# EAGLE design LightWalker (EAGLE 9.1.3)
LightWalker Schematic
REV: 3.0a
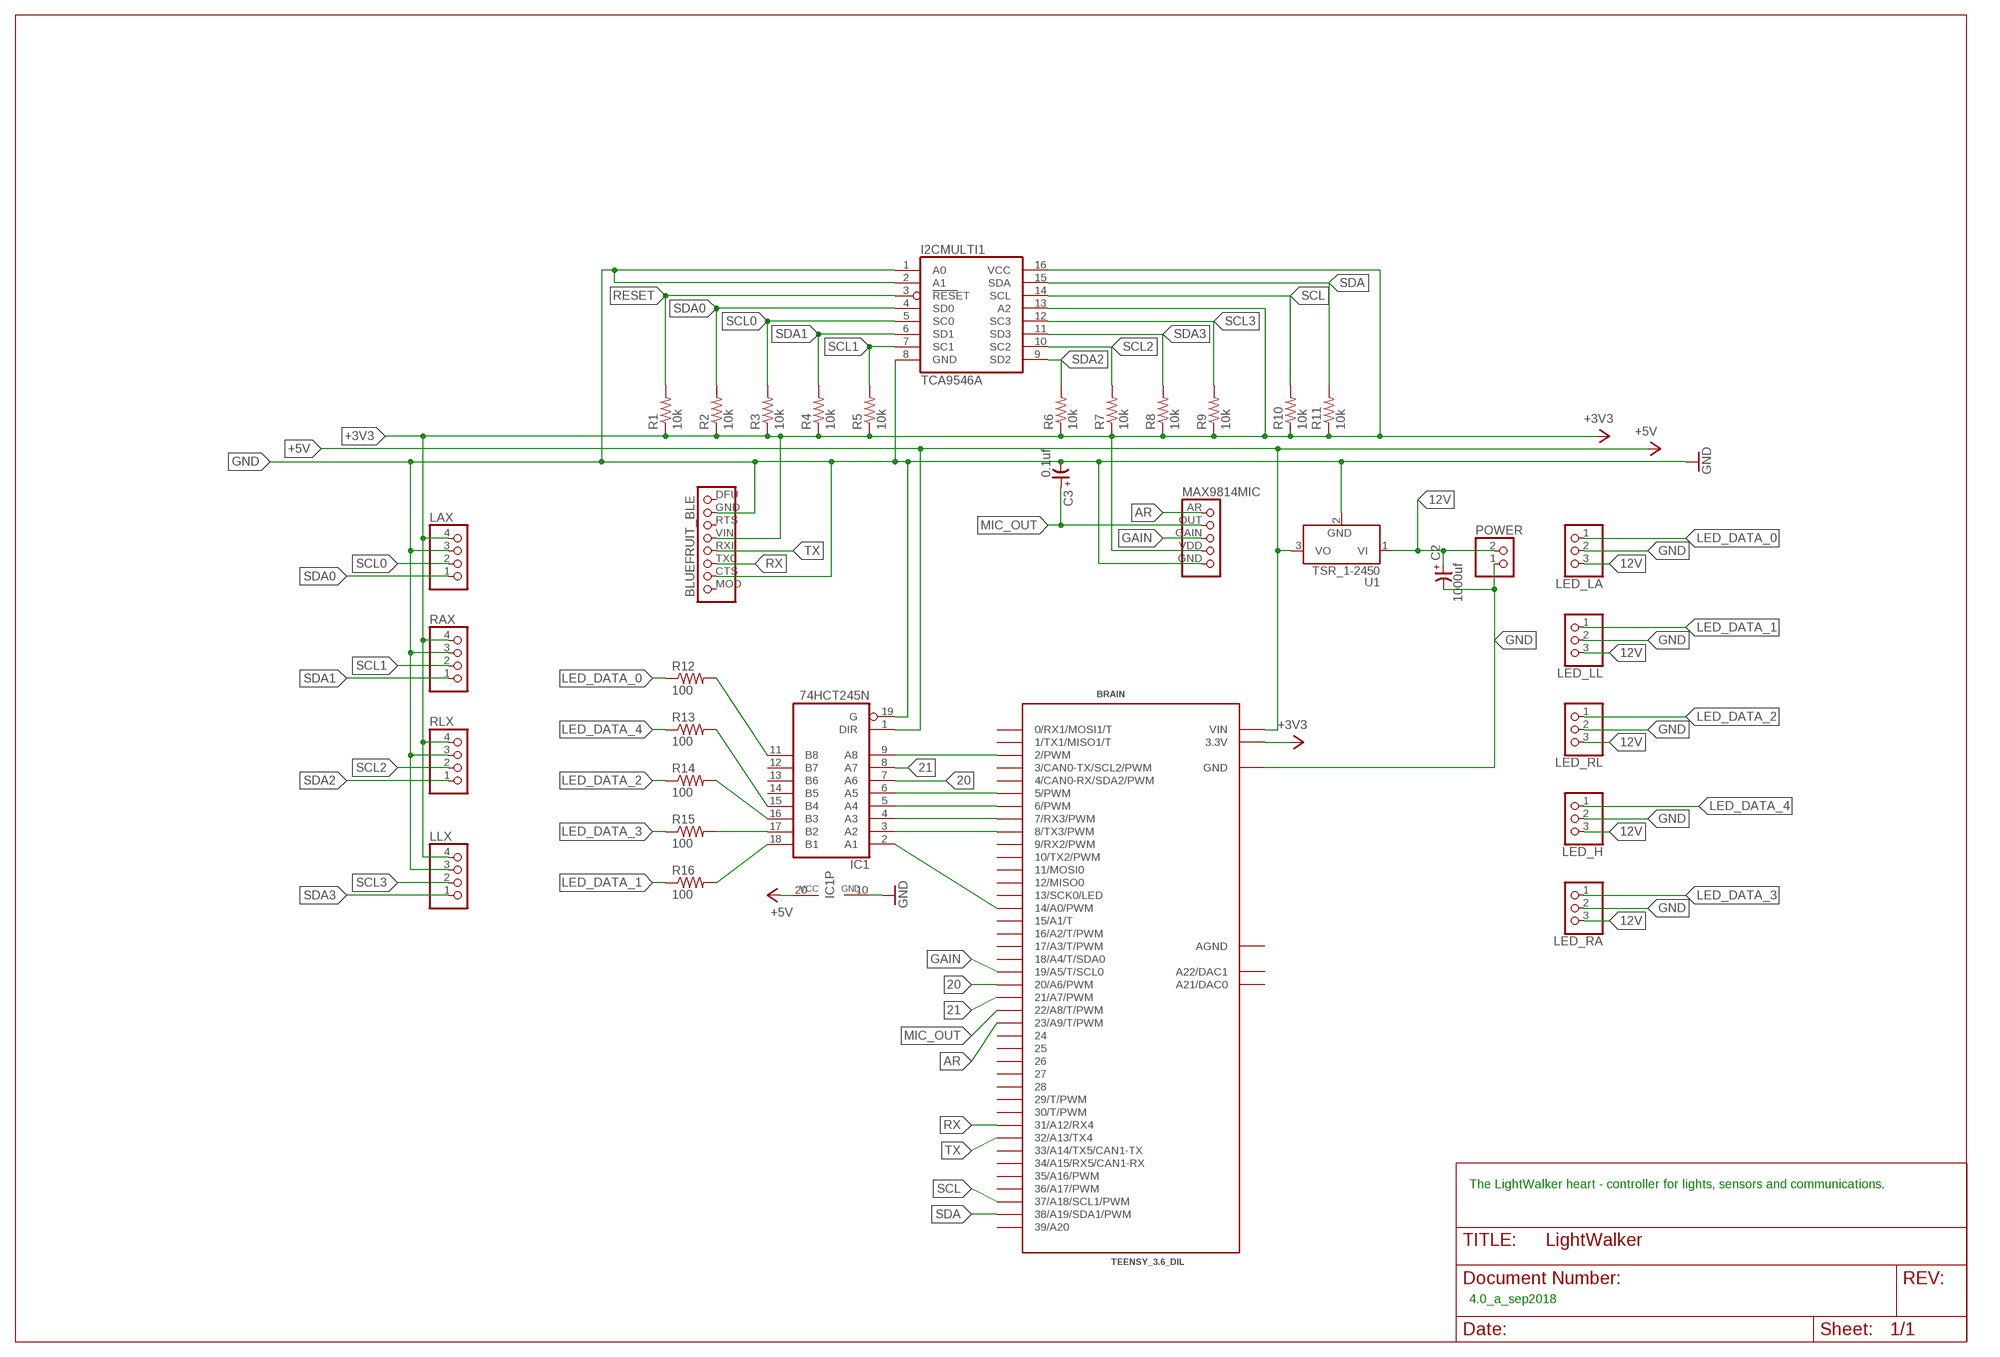
[diagram p0: schematic, sheet 1]

## Parts
BRAIN  TEENSY_3.6_DIL  [TEENSY_3.6_DIL]
C2  1000uf  CP-SV-K  [SV-K]
C3  0.1uf  CP-3225  [3225]
I2CMULTI1  TCA9546A  [SOIC16_LONGPAD]
IC1  74HCT245N  [DIL20]
LAX  2.54MM_TERMINAL_BLOCK-4  [TB_1X4]
LED_H  2.54MM_TERMINAL_BLOCK-3  [TB_1X3]
LED_LA  2.54MM_TERMINAL_BLOCK-3  [TB_1X3]
LED_LL  2.54MM_TERMINAL_BLOCK-3  [TB_1X3]
LED_RA  2.54MM_TERMINAL_BLOCK-3  [TB_1X3]
LED_RL  2.54MM_TERMINAL_BLOCK-3  [TB_1X3]
LLX  2.54MM_TERMINAL_BLOCK-4  [TB_1X4]
POWER  2.54MM_TERMINAL_BLOCK-2  [TB_1X2]
R1  10k  R-US_R1206  [R1206]
R2  10k  R-US_R1206  [R1206]
R3  10k  R-US_R1206  [R1206]
R4  10k  R-US_R1206  [R1206]
R5  10k  R-US_R1206  [R1206]
R6  10k  R-US_R1206  [R1206]
R7  10k  R-US_R1206  [R1206]
R8  10k  R-US_R1206  [R1206]
R9  10k  R-US_R1206  [R1206]
R10  10k  R-US_R1206  [R1206]
R11  10k  R-US_R1206  [R1206]
R12  100  R-US_R1206  [R1206]
R13  100  R-US_R1206  [R1206]
R14  100  R-US_R1206  [R1206]
R15  100  R-US_R1206  [R1206]
R16  100  R-US_R1206  [R1206]
RAX  2.54MM_TERMINAL_BLOCK-4  [TB_1X4]
RLX  2.54MM_TERMINAL_BLOCK-4  [TB_1X4]
U1  TSR_1-2450  [TSR-1]
U$1  BLUEFRUIT_BLE_UART_FRIENDALL  [BLUEFRUIT_BLE_UART_FRIEND_ALL]
U$4  MAX9814MICALL  [MAX9814MIC]

## Nets
12V: C2.+ LED_H.3 LED_LA.3 LED_LL.3 LED_RA.3 LED_RL.3 POWER.2 U1.1(VI)
20: BRAIN.20/A6(20/A6/PWM) IC1.7(A6)
21: BRAIN.21/A7(21/A7/PWM) IC1.8(A7)
+3V3: BRAIN.3.3V BRAIN.3.3V3(3.3V) I2CMULTI1.13(A2) I2CMULTI1.16(VCC) LAX.4 LLX.4 R1.1 R2.1 R3.1 R4.1 R5.1 R6.1 R7.1 R8.1 R9.1 R10.1 R11.1 RAX.4 RLX.4 U$1.VIN U$4.VDD
+5V: BRAIN.VIN IC1.1(DIR) IC1.20(VCC) U1.3(VO)
AR: BRAIN.23/A9(23/A9/T/PWM) U$4.AR
GAIN: BRAIN.19/A5(19/A5/T/SCL0) U$4.GAIN
GND: BRAIN.GND BRAIN.GND1(GND) C2.- C3.2(-) I2CMULTI1.1(A0) I2CMULTI1.2(A1) I2CMULTI1.8(GND) IC1.10(GND) IC1.19(G) LAX.3 LED_H.2 LED_LA.2 LED_LL.2 LED_RA.2 LED_RL.2 LLX.3 POWER.1 RAX.3 RLX.3 U1.2(GND) U$1.CTS U$1.GND U$4.GND
LED_DATA_0: LED_LA.1 R12.1
LED_DATA_1: LED_LL.1 R16.1
LED_DATA_2: LED_RL.1 R14.1
LED_DATA_3: LED_RA.1 R15.1
LED_DATA_4: LED_H.1 R13.1
MIC_OUT: BRAIN.22/A8(22/A8/T/PWM) C3.1(+) U$4.OUT
N$1: BRAIN.2(2/PWM) IC1.9(A8)
N$2: BRAIN.5(5/PWM) IC1.6(A5)
N$3: BRAIN.6(6/PWM) IC1.5(A4)
N$5: BRAIN.7(7/RX3/PWM) IC1.4(A3)
N$6: BRAIN.8(8/TX3/PWM) IC1.3(A2)
N$9: IC1.11(B8) R12.2
N$10: IC1.15(B4) R13.2
N$11: IC1.16(B3) R14.2
N$12: IC1.17(B2) R15.2
N$13: IC1.18(B1) R16.2
PIN14: BRAIN.14/A0(14/A0/PWM) IC1.2(A1)
RESET: I2CMULTI1.3(RESET) R1.2
RX: BRAIN.31/A12(31/A12/RX4) U$1.TX0(TXO)
SCL: BRAIN.37/A18(37/A18/SCL1/PWM) I2CMULTI1.14(SCL) R10.2
SCL0: I2CMULTI1.5(SC0) LAX.2 R3.2
SCL1: I2CMULTI1.7(SC1) R5.2 RAX.2
SCL2: I2CMULTI1.10(SC2) R7.2 RLX.2
SCL3: I2CMULTI1.12(SC3) LLX.2 R9.2
SDA: BRAIN.38/A19(38/A19/SDA1/PWM) I2CMULTI1.15(SDA) R11.2
SDA0: I2CMULTI1.4(SD0) LAX.1 R2.2
SDA1: I2CMULTI1.6(SD1) R4.2 RAX.1
SDA2: I2CMULTI1.9(SD2) R6.2 RLX.1
SDA3: I2CMULTI1.11(SD3) LLX.1 R8.2
TX: BRAIN.32/A13(32/A13/TX4) U$1.RXI
Unconnected: BRAIN.0(0/RX1/MOSI1/T) BRAIN.1(1/TX1/MISO1/T) BRAIN.3(3/CAN0-TX/SCL2/PWM) BRAIN.4(4/CAN0-RX/SDA2/PWM) BRAIN.9(9/RX2/PWM) BRAIN.10(10/TX2/PWM) BRAIN.11(11/MOSI0) BRAIN.12(12/MISO0) BRAIN.13(13/SCK0/LED) BRAIN.15/A1(15/A1/T) BRAIN.16/A2(16/A2/T/PWM) BRAIN.17/A3(17/A3/T/PWM) BRAIN.18/A4(18/A4/T/SDA0) BRAIN.24 BRAIN.25 BRAIN.26 BRAIN.27 BRAIN.28 BRAIN.29(29/T/PWM) BRAIN.30(30/T/PWM) BRAIN.33/A14(33/A14/TX5/CAN1-TX) BRAIN.34/A15(34/A15/RX5/CAN1-RX) BRAIN.35/A16(35/A16/PWM) BRAIN.36/A17(36/A17/PWM) BRAIN.39/A20 BRAIN.A21(A21/DAC0) BRAIN.A22(A22/DAC1) IC1.12(B7) IC1.13(B6) IC1.14(B5) U$1.DFU U$1.MOD U$1.RTS

## Notes on the sheet
- The LightWalker heart - controller for lights, sensors and communications.
- 4.0_a_sep2018

## Power pins joined to a net without a drawn wire
AGND: BRAIN.AGND

## Library data of the parts
BRAIN = Teensy3.0:TEENSY_3.6_DIL: Teensy 3.6 DIL Package
C2 = cap-master:CP-: POLARIZED CAP
C3 = cap-master.rpt:CP-: POLARIZED CAP
I2CMULTI1 = minty:TCA9546A
IC1 = 74xx-eu:74*245: Octal BUS TRANSCEIVER, 3-state
LAX LLX RAX RLX = minty:2.54MM_TERMINAL_BLOCK-4
LED_H LED_LA LED_LL LED_RA LED_RL = minty:2.54MM_TERMINAL_BLOCK-3
POWER = minty:2.54MM_TERMINAL_BLOCK-2
R1-R16 = resistor:R-US_: RESISTOR, American symbol
U1 = _traco_tsr-1:TSR_1-*: TRACO TSR-1 Series Point-of-Load DC/DC-Converters Vi max. 36 V; Vo = (1.2 .. 15)V ±2%; Io = 0 .. 1 A SIP-Package (drop-in replacement for 78xx linear voltage regulators in TO220-package, vertically assembled) Source: www.tracopower.com Technologies: TSR 1- Vi (V) Vo (V) ±2% Io = 0 .. 1 A 24_ ( generic ) 2412 4.6 .. 36 1.2 2415 4.6 .. 36 1.5 2418 4.6 .. 36 1.8 2425 4.6 .. 36 2.5 2433 4.75.. 36 3.3 2450 6.5 .. 36 5.0 2465 9.0 .. 36 6.5 2490 12 .. 36 9.0 24120 15 .. 36 12 24150 18 .. 36 15 Author: Dipl.-Ing. FH Rainer Bayer HHN Hochschule Heilbronn, rainer.bayer@hs-heilbronn.de Ingenieurbüro ing-rb, mail@ing-rb.de
U$1 = minty:BLUEFRUIT_BLE_UART_FRIEND
U$4 = minty:MAX9814MIC

## Board
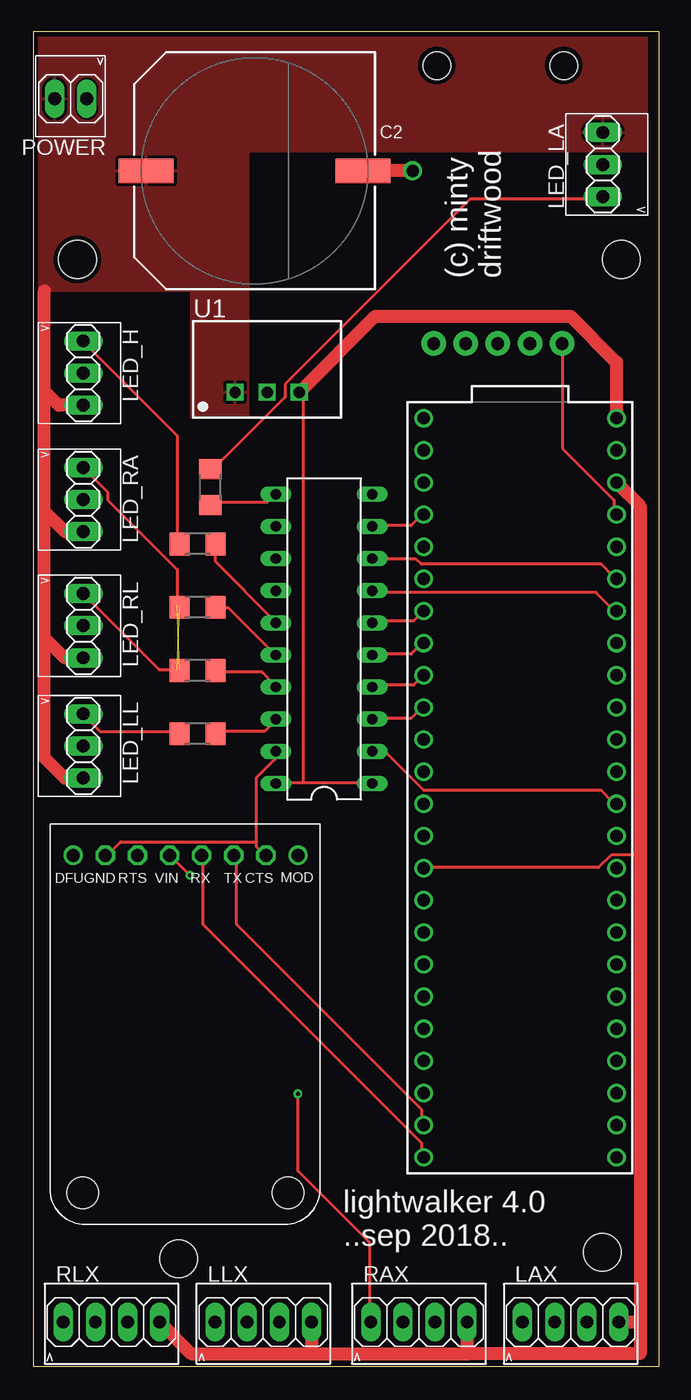
[diagram p1: board, top side]
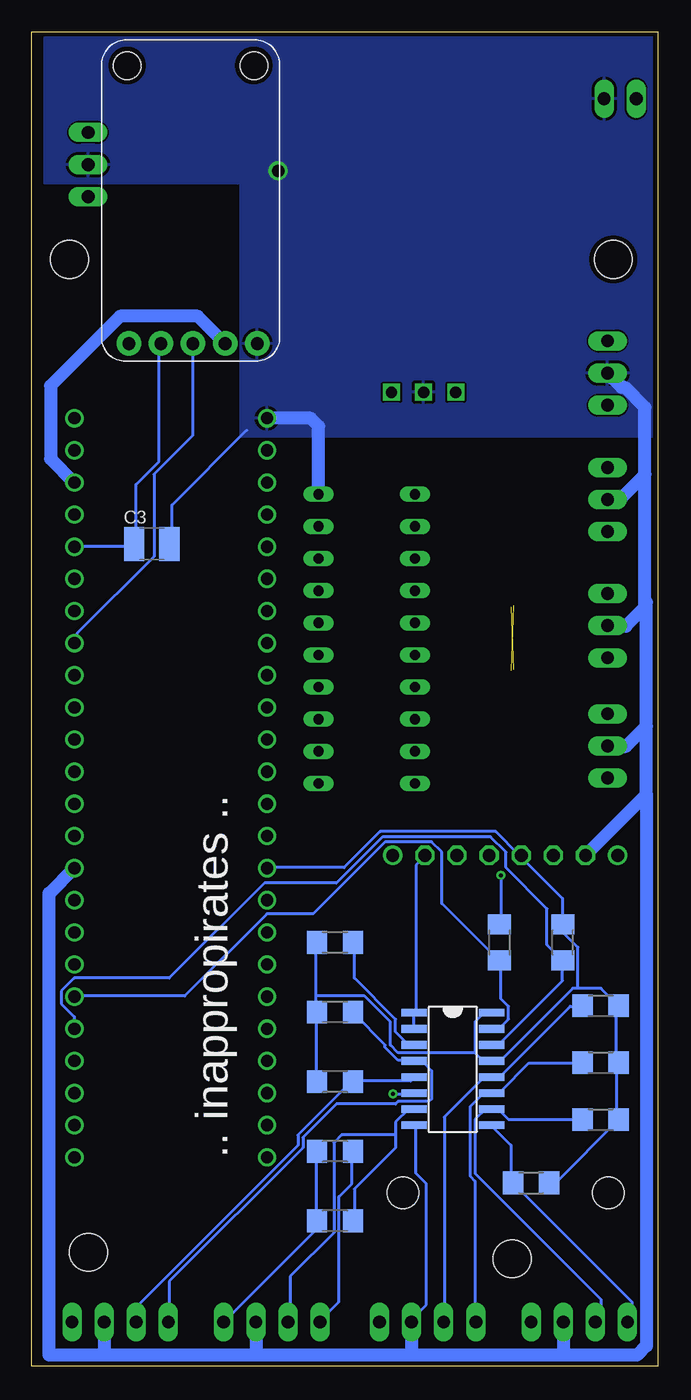
[diagram p2: board, bottom side, seen from below]

Size 49.5 x 105.5 mm. Coordinates in mm from the lower left corner, seen from the top.
Outline: 0,0 49.5,0 49.5,105.5 0,105.5 0,0
Copper layers (1*16): Top 0.0356mm / dielectric 1.5011mm / Bottom 0.0356mm
Design rules "LaenPCBOrder *": minimum track width 10mil, minimum drill 13mil, track to track 6mil, track to pad 6mil, pad to pad 6mil, via to via 6mil, smd to smd 6mil, copper to edge 15mil, drill to drill 6mil, minimum pad ring 7mil, minimum via ring 7mil, stop-mask expansion 3mil, vias tented up to drill 0mil, thermal gap 10mil
Holes 3 mm at 3.5,87.5 46.5,87.5 11.5,8.5 45,9

### Footprints (pad centres in the part's own frame; a part is rotated, then mirrored left to right if it is on the bottom)
TEENSY_3.6_DIL = drill 0.965: 0 -7.62,25.4; 1 -7.62,22.86; 2 -7.62,20.32; 3 -7.62,17.78; 3.3V 7.62,22.86; 3.3V3 -7.62,-7.62; 4 -7.62,15.24; 5 -7.62,12.7; 6 -7.62,10.16; 7 -7.62,7.62; 8 -7.62,5.08; 9 -7.62,2.54; 10 -7.62,0; 11 -7.62,-2.54; 12 -7.62,-5.08; 13 7.62,-5.08; 14/A0 7.62,-2.54; 15/A1 7.62,0; 16/A2 7.62,2.54; 17/A3 7.62,5.08; 18/A4 7.62,7.62; 19/A5 7.62,10.16; 20/A6 7.62,12.7; 21/A7 7.62,15.24; 22/A8 7.62,17.78; 23/A9 7.62,20.32; 24 -7.62,-10.16; 25 -7.62,-12.7; 26 -7.62,-15.24; 27 -7.62,-17.78; 28 -7.62,-20.32; 29 -7.62,-22.86; 30 -7.62,-25.4; 31/A12 -7.62,-27.94; 32/A13 -7.62,-30.48; 33/A14 7.62,-30.48; 34/A15 7.62,-27.94; 35/A16 7.62,-25.4; 36/A17 7.62,-22.86; 37/A18 7.62,-20.32; 38/A19 7.62,-17.78; 39/A20 7.62,-15.24; A21 7.62,-12.7; A22 7.62,-10.16; AGND 7.62,25.4; GND -7.62,27.94; GND1 7.62,-7.62; VIN 7.62,27.94
SV-K = smd 4.318 x 1.93: + -8.572,0; - 8.572,0
3225 = smd 1.6 x 2.7: 1 -1.4,0; 2 1.4,0
SOIC16_LONGPAD = smd 0.61 x 2.032: 1 -4.445,-3.251; 2 -3.175,-3.251; 3 -1.905,-3.251; 4 -0.635,-3.251; 5 0.635,-3.251; 6 1.905,-3.251; 7 3.175,-3.251; 8 4.445,-3.251; 9 4.445,2.87; 10 3.175,2.87; 11 1.905,2.87; 12 0.635,2.87; 13 -0.635,2.87; 14 -1.905,2.87; 15 -3.175,2.87; 16 -4.445,2.87
DIL20 = drill 0.813 long: 1 -11.43,-3.81; 2 -8.89,-3.81; 3 -6.35,-3.81; 4 -3.81,-3.81; 5 -1.27,-3.81; 6 1.27,-3.81; 7 3.81,-3.81; 8 6.35,-3.81; 9 8.89,-3.81; 10 11.43,-3.81; 11 11.43,3.81; 12 8.89,3.81; 13 6.35,3.81; 14 3.81,3.81; 15 1.27,3.81; 16 -1.27,3.81; 17 -3.81,3.81; 18 -6.35,3.81; 19 -8.89,3.81; 20 -11.43,3.81
TB_1X4 = drill 1.016 long: 1 -3.81,-0.1; 2 -1.27,-0.1; 3 1.27,-0.1; 4 3.81,-0.1
TB_1X3 = drill 1.016 long: 1 -2.55,-0.04; 2 -0.01,-0.04; 3 2.53,-0.04
TB_1X2 = drill 1.016 long: 1 -1.23,-0.2; 2 1.31,-0.2
R1206 = smd 1.6 x 1.803: 1 -1.422,0; 2 1.422,0
TSR-1 = drill 0.9 square: 1 -2.54,0; 2 0,0; 3 2.54,0
BLUEFRUIT_BLE_UART_FRIEND_ALL = drill 1.016 octagon: CTS 4.1,2.61; GND 16.8,2.61; RTS 14.26,2.61; RXI 9.18,2.61; TX0 6.64,2.61; VIN 11.72,2.61 | drill 1.016: DFU 19.34,2.61; MOD 1.56,2.61 | hole 2.5: 2.35,29.3; 18.6,29.3
MAX9814MIC = drill 1 pad 1.93: AR -10.16,4.318; GAIN -10.16,-0.762; GND -10.16,-5.842; OUT -10.16,1.778; VDD -10.16,-3.302 | hole 2.2: 11.811,4.445; 11.811,-5.588

### Placement (x,y rotation side)
BRAIN  38.5,47 0 top
C2  17.5,94.5 0 top
C3  40,65 0 bottom
I2CMULTI1  16,23.5 270 bottom
IC1  23,57.5 90 top
LAX  42.5,3.6 0 top
LED_H  4,78.5 270 top
LED_LA  45,95 90 top
LED_LL  4,49.03 270 top
LED_RA  4,68.5 270 top
LED_RL  4,58.53 270 top
LLX  18.19,3.6 0 top
POWER  3,100 180 top
R1  25.5,33.5 0 bottom
R2  25.5,28 0 bottom
R3  25.5,22.5 0 bottom
R4  25.5,17 0 bottom
R5  25.5,11.5 0 bottom
R6  10,14.5 180 bottom
R7  4.5,19.5 180 bottom
R8  4.5,24 180 bottom
R9  4.5,28.5 180 bottom
R10  7.5,33.5 270 bottom
R11  12.5,33.5 270 bottom
R12  14,69.5 270 top
R13  13,65 0 top
R14  13,60 0 top
R15  13,55 0 top
R16  13,50 0 top
RAX  30.5,3.6 0 top
RLX  6.19,3.6 0 top
U1  18.5,77 0 top
U$1  22.5,43 180 top
U$4  37.5,91 90 bottom

### Tracks (layer width: path | path; a pad name or v marks a point on that pad's centre or on a via)
12V
  Top 1.016: LED_H.3 2.03,75.97 0.89,77.11 | LED_RA.3 2.53,65.97 0.89,67.61 | 0.89,67.61 0.89,77.11 | LED_RL.3 2.5,56 0.89,57.61 | 0.89,57.61 0.89,67.61 | LED_LL.3 2.5,46.5 0.89,48.11 0.89,57.61 | 0.89,77.11 0.89,85
  pour Top: 0,105.5 48.5,105.5 48.5,96 17,96 17,75 12.5,75 12.5,85 0,85
20
  Top 0.254: IC1.7 26.82,61.16 44.5,61.16 45.92,59.74 BRAIN.20/A6
21
  Top 0.254: IC1.8 26.82,63.8 30.28,63.8 30.68,63.4 44.91,63.4 45.92,62.38 BRAIN.21/A7
+3V3  (via drill 0.33)
  Top 0.254: BRAIN.3.3V3 30.89,39.42 44.7,39.42 45.72,40.44 47.55,40.44 48,40.44 | v12.39,38.81 10.97,40.23 U$1.VIN
  Top 1.016: BRAIN.3.3V 48,67.98 48,40.44 48,3.66 | 34.5,1 48,1 48,3.66 | RAX.4 34.31,1.19 34.5,1 | LAX.4 47.84,3.5 48,3.66 | RLX.4 12.5,1 22,1 | 22,1 34.5,1 | LLX.4 22,1
  Bottom 0.254: R4.1 27.03,16.87 27.03,11.58 R5.1 27.03,11.38 27.03,10.77 34.14,3.66 RAX.4 | v12.39,38.81 12.39,34.95 R11.1 | R3.1 27.03,22.55 27.03,27.84 R2.1 27.03,28.04 27.03,29.26 | 27.03,29.26 27.03,33.33 R1.1 | 14.43,24.79 13.82,24.18 13.21,24.18 I2CMULTI1.13 13.01,24.18 12.39,24.18 6.71,29.87 6.3,29.87 | 14.43,24.79 14.43,27.23 13.82,27.84 13.21,27.84 I2CMULTI1.16 | R6.1 8.53,14.63 7.92,14.63 3.25,19.3 R7.1 3.25,19.51 3.25,23.98 R8.1 3.25,24.18 3.25,28.45 R9.1 3.25,28.65 4.47,29.87 6.3,29.87 | 27.03,29.26 23.16,29.26 21.13,27.23 21.13,25.4 20.52,24.79 14.43,24.79 | 6.3,29.87 6.3,33.12 7.32,34.14 7.32,34.75 R10.1 7.52,34.95 7.52,36.98 10.77,40.23 U$1.VIN 10.97,40.44 12.8,42.27 21.95,42.27 24.79,39.42 30.68,39.42 BRAIN.3.3V3
  Bottom 1.016: U$4.VDD 36.36,83 42.5,83 48,77.5 48,71.74 BRAIN.3.3V
+5V
  Top 0.254: 21.34,46.13 26.62,46.13 IC1.1 | 21.34,46.13 19.3,46.13 IC1.20 | 21.34,46.13 21.34,76.61 U1.3
  Top 1.016: U1.3 27.04,83 42.5,83 46.12,79.38 BRAIN.VIN
AR
  Top 0.254: BRAIN.23/A9 45.92,67.46 45.92,68.48 41.86,72.54 41.86,80.67 U$4.AR
GAIN
  Bottom 0.254: BRAIN.19/A5 45.92,57.3 45.92,57.91 39.83,64.01 39.83,70.51 36.78,73.56 36.78,80.67 U$4.GAIN
GND  (via drill 1)
  Top 0.254: 17.68,41.45 17.68,41.05 18.29,40.44 U$1.CTS | 17.68,41.45 17.68,46.53 19.1,47.95 19.1,48.56 IC1.19 | 17.68,41.45 6.91,41.45 5.89,40.44 U$1.GND
  Top 1.016: v30,94.5 C2.-
  Bottom 0.254: C3.2 38.41,65.02 38.41,68.09 32.5,74 | I2CMULTI1.2 19.3,26.82 19.3,27.84 I2CMULTI1.1 19.1,28.04 19.1,39.62 18.49,40.23 U$1.CTS | I2CMULTI1.8 19.1,18.9 19.1,15.24 18.29,14.43 18.29,4.88 19.3,3.86 LLX.3
  Bottom 1.016: IC1.10 26.81,74.31 27.44,74.94 BRAIN.GND | LED_RA.2 3.01,68.51 3,68.5 1,70.5 | LED_RL.2 2.54,58.54 2.5,58.5 1,60 1,60.5 | 1,60.5 1,70.5 | LED_LL.2 3.92,49 2.5,49 0.89,50.61 | 1,60.5 0.89,60.39 0.89,50.61 | U$1.GND 0.89,45.2 | 0.89,45.2 0.89,50.61 | 0.89,45.2 0.89,29.46 0.89,1.61 1.61,0.89 | 44,0.89 48.11,0.89 48.11,37.39 BRAIN.GND1 | 44,0.89 43.77,1.12 LAX.3 | 31.5,0.89 19.5,0.89 19.46,0.93 | 31.5,0.89 44,0.89 | LLX.3 19.46,0.93 | RAX.3 31.77,1.16 31.5,0.89 | LED_H.2 2.84,77.39 2.61,77.39 1,75.78 1,70.5 | 1.61,0.89 | 1.61,0.89 7.5,0.89 | 7.5,0.89 19.42,0.89 19.46,0.93 | RLX.3 7.46,0.93 7.5,0.89
  pour Bottom: 0,105.5 48.5,105.5 48.5,93.5 33,93.5 33,73.5 7,73.5 0,73.5
LED_DATA_0
  Top 0.254: R12.1 14.02,71.12 14.43,71.12 19.91,76.61 19.91,77.62 34.54,92.25 44.91,92.25 LED_LA.1
LED_DATA_1
  Top 0.254: R16.1 11.38,50.19 5.28,50.19 4.06,51.41 LED_LL.1
LED_DATA_2  (1 unrouted)
  Top 0.254: 11.38,55.07 9.96,55.07 4.06,60.96 LED_RL.1
LED_DATA_3  (1 unrouted)
  Top 0.254: 11.38,60.15 11.38,62.99 5.89,68.48 5.89,69.09 4.06,70.92 LED_RA.1
LED_DATA_4
  Top 0.254: R13.1 11.38,65.02 11.38,73.56 4.06,80.87 LED_H.1
MIC_OUT
  Bottom 0.254: BRAIN.22/A8 45.92,64.82 41.45,64.82 C3.1 41.25,65.02 41.25,69.7 39.42,71.53 39.42,80.67 U$4.OUT
N$1
  Top 0.254: IC1.9 26.82,66.45 29.87,66.45 30.68,67.26 BRAIN.2
N$2
  Top 0.254: IC1.6 26.82,58.93 30.07,58.93 30.68,59.54 BRAIN.5
N$3
  Top 0.254: IC1.5 26.82,56.29 29.87,56.29 30.68,57.1 BRAIN.6
N$5
  Top 0.254: IC1.4 26.82,53.85 30.07,53.85 30.68,54.46 BRAIN.7
N$6
  Top 0.254: IC1.3 26.82,51.21 29.87,51.21 30.68,52.02 BRAIN.8
N$9
  Top 0.254: R12.2 14.02,68.28 18.49,68.28 19.1,68.89 IC1.11
N$10
  Top 0.254: R13.2 14.43,64.82 14.43,63.6 19.1,58.93 IC1.15
N$11
  Top 0.254: R14.2 14.43,59.94 15.44,59.94 19.1,56.29 IC1.16
N$12
  Top 0.254: R15.2 14.43,54.86 18.09,54.86 19.1,53.85 IC1.17
N$13
  Top 0.254: R16.2 14.43,50.19 18.29,50.19 19.1,51 IC1.18
PIN14
  Top 0.254: IC1.2 26.82,48.56 27.84,48.56 30.89,45.52 44.91,45.52 45.92,44.5 BRAIN.14/A0
RESET
  Bottom 0.254: R1.2 23.98,33.33 23.98,30.68 20.73,27.43 20.73,26.42 19.91,25.6 19.3,25.6 I2CMULTI1.3
RX
  Top 0.254: BRAIN.31/A12 30.68,19.1 30.68,20.32 16.05,34.95 16.05,40.23 U$1.TX0
SCL
  Bottom 0.254: I2CMULTI1.14 13.01,25.6 12.39,25.6 7.52,30.48 7.52,31.9 R10.2 7.52,32.11 8.74,33.33 8.74,36.17 11.99,39.42 11.99,40.64 13.21,41.86 21.74,41.86 25.4,38.2 31.09,38.2 38.61,30.68 46.13,30.68 47.14,29.67 47.14,28.65 46.13,27.64 46.13,26.82 BRAIN.37/A18
SCL0
  Bottom 0.254: I2CMULTI1.5 19.3,22.76 19.51,22.55 23.98,22.55 R3.2 24.18,22.55 28.45,18.29 28.45,17.48 41.05,4.88 41.05,3.66 LAX.2
SCL1
  Bottom 0.254: 20.73,18.29 20.73,19.3 19.71,20.32 19.3,20.32 I2CMULTI1.7 | 20.73,18.29 20.73,17.27 23.98,14.02 23.98,11.58 R5.2 | 20.73,18.29 24.99,18.29 25.6,17.68 25.6,10.57 29.06,7.11 29.06,3.66 RAX.2
SCL2
  Bottom 0.254: R7.2 6.1,19.51 11.79,19.51 12.6,20.32 13.01,20.32 I2CMULTI1.10 13.21,20.32 13.61,20.32 14.43,19.51 14.43,15.24 4.47,5.28 4.47,4.91 RLX.2
SCL3
  Bottom 0.254: R9.2 6.1,28.45 6.91,28.45 12.39,22.96 13.01,22.96 I2CMULTI1.12 13.21,22.76 13.82,22.76 16.87,19.71 16.87,3.66 LLX.2
SDA
  Bottom 0.254: I2CMULTI1.15 13.01,26.82 12.39,26.82 11.79,27.43 11.79,28.45 12.39,29.06 12.39,31.9 R11.2 12.6,32.11 17.07,36.58 17.07,40.64 17.88,41.45 21.54,41.45 27.23,35.76 30.89,35.76 37.39,29.26 45.92,29.26 BRAIN.38/A19
SDA0
  Bottom 0.254: R2.2 23.98,27.84 21.54,25.4 21.54,25.2 20.52,24.18 19.3,24.18 I2CMULTI1.4 19.1,23.98 18.49,23.98 17.88,23.37 17.88,21.13 18.09,20.93 20.52,20.93 20.73,20.73 25.4,20.73 28.04,18.09 28.04,17.27 38.61,6.71 38.61,3.66 LAX.1
SDA1  (via drill 0.33)
  Top 0.254: v20.93,21.54 20.93,15.44 26.62,9.75 26.62,3.66 RAX.1
  Bottom 0.254: R4.2 24.18,16.87 24.18,14.43 25.2,13.41 25.2,5.08 26.62,3.66 RAX.1 | v20.93,21.54 19.3,21.54 I2CMULTI1.6
SDA2
  Bottom 0.254: I2CMULTI1.9 13.01,18.9 11.58,17.48 11.58,14.63 R6.2 11.38,14.43 2.03,5.08 2.03,3.86 RLX.1
SDA3
  Bottom 0.254: R8.2 6.1,23.98 10.16,23.98 12.39,21.74 13.01,21.74 I2CMULTI1.11 13.21,21.54 13.82,21.54 14.83,20.52 14.83,15.04 14.43,14.63 14.43,3.66 LLX.1
TX
  Top 0.254: BRAIN.32/A13 30.68,16.66 30.68,17.68 13.41,34.95 13.41,40.23 U$1.RXI

### Text on the board
tNames: (c) minty / driftwood | lightwalker 4.0 / ..sep 2018..
bNames: .. inappropirates ..